# Altium project ECE453-PWR.PrjPcb
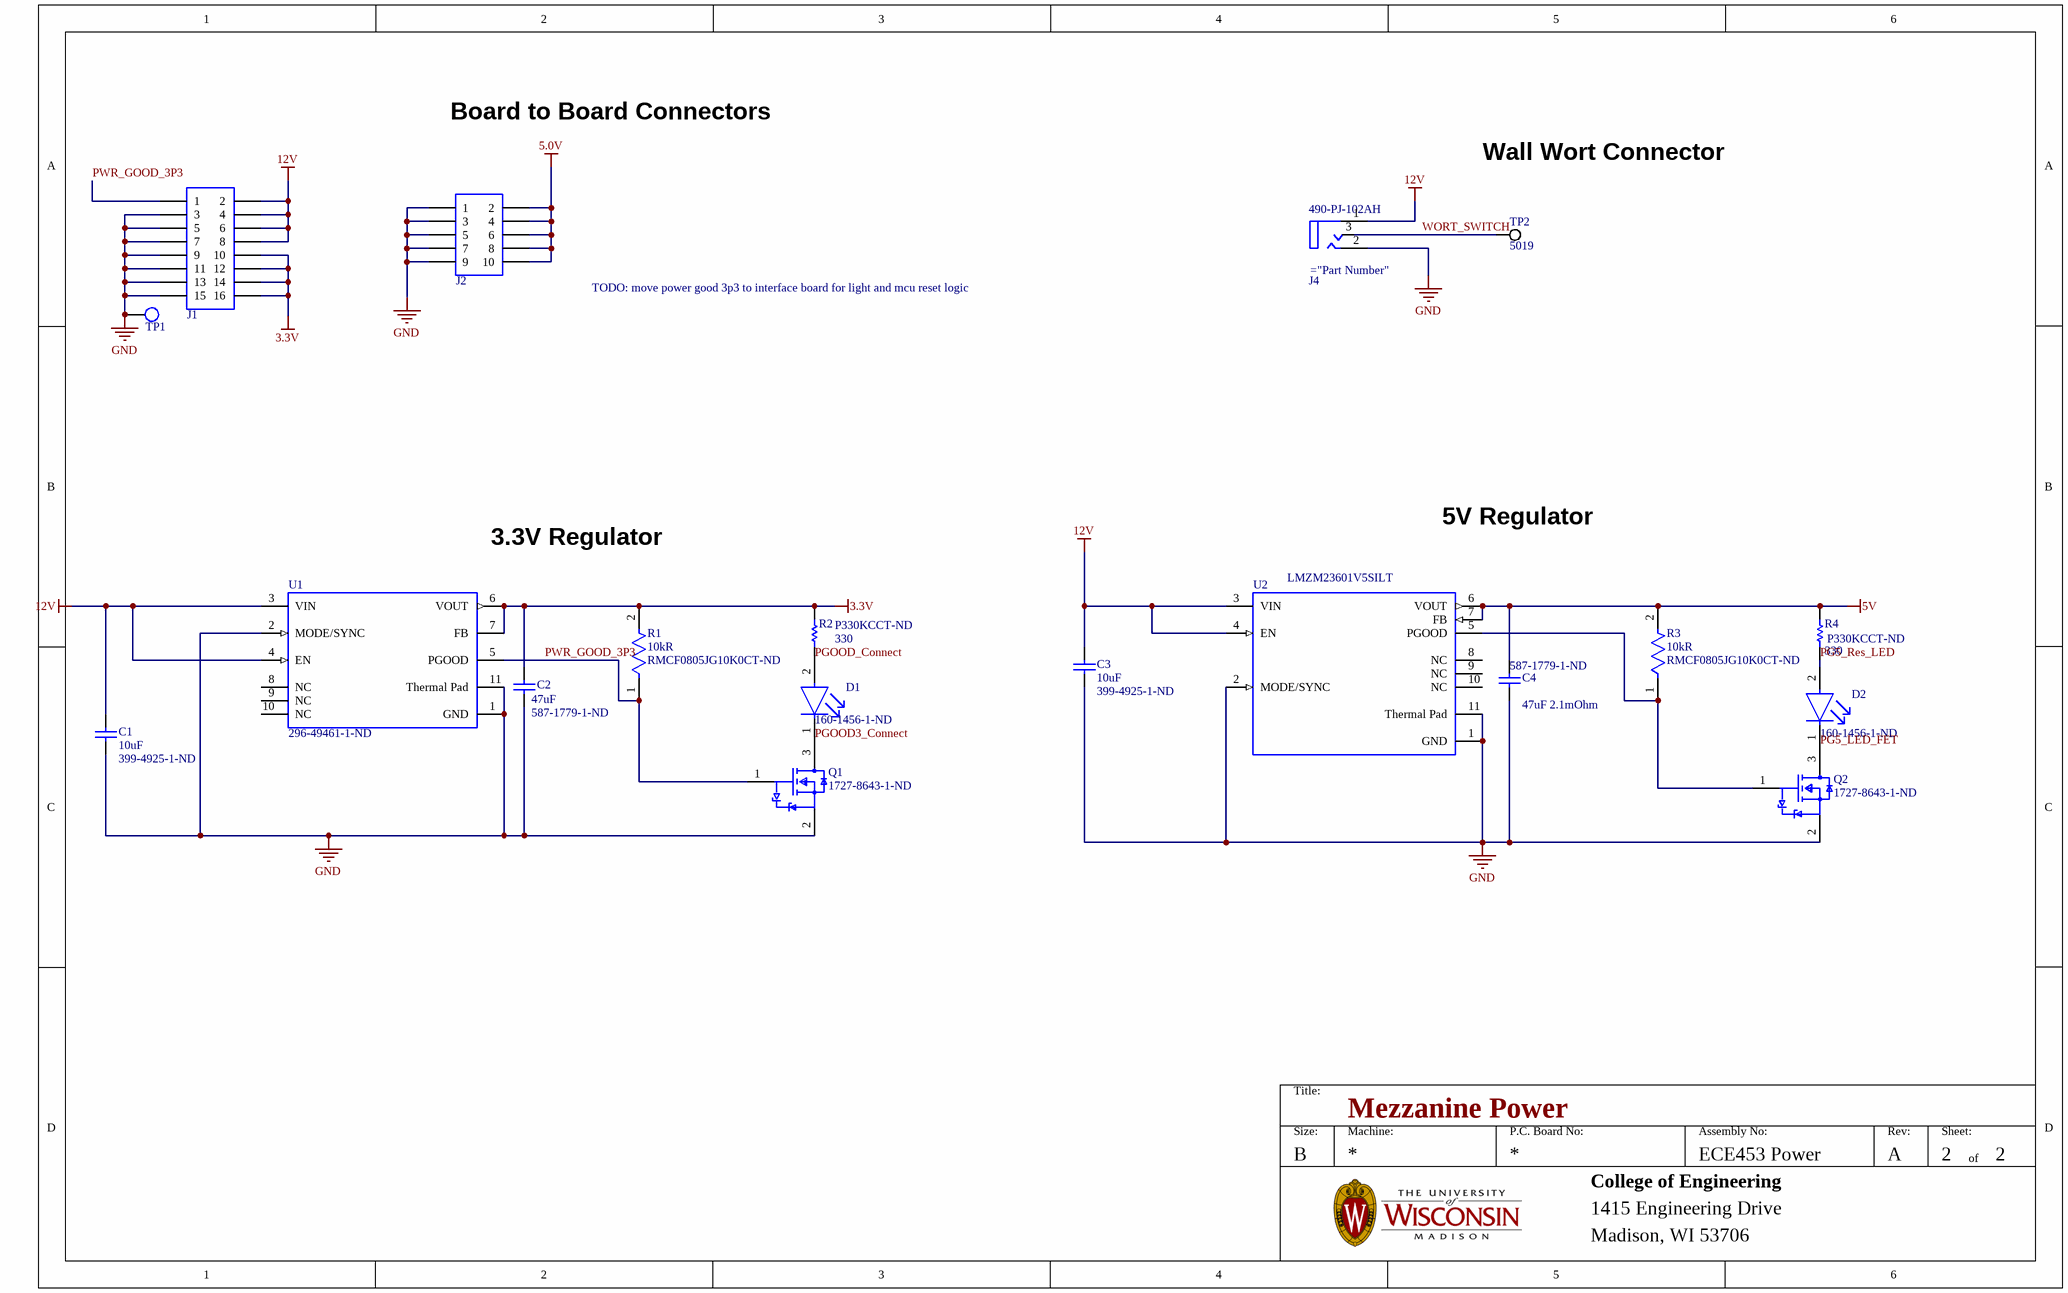
[diagram p0: 02 Mobile Power.SchDoc]
1 sheet, 19 parts. Net scope: global (net labels, ports and power ports of the same name join across sheets).
Board file: ECE453_PWR.PcbDoc

## Sheet 02 Mobile Power.SchDoc: Mezzanine Power
size B; Author: JSK; Revision: A; SheetNumber: 2; SheetTotal: 2; AssemblyNumber: ECE453 Power; CurrentDate: 1/09/2018

### Parts
C1  value 10uF  Supplier Part Number 1: 399-4925-1-ND  [6-0805_M]  (hidden comment: Cap)
C2  value 47uF  Supplier Part Number 1: 587-1779-1-ND  [6-0805_M]  (hidden comment: Cap)
C3  value 10uF  Supplier Part Number 1: 399-4925-1-ND  [6-0805_M]  (hidden comment: Cap)
C4  value 47uF 2.1mOhm  Supplier Part Number 1: 587-1779-1-ND  [6-0805_M]  (hidden comment: Cap)
D1  Supplier Part Number 1: 160-1456-1-ND  [Lite-On_LTST-C230KGKT_0]  (hidden comment: LTST-C230KGKT)
D2  Supplier Part Number 1: 160-1456-1-ND  [Lite-On_LTST-C230KGKT_0]  (hidden comment: LTST-C230KGKT)
J1  CONN_HEADER_MALE_8x2  [SBH11-PBPC-D08-ST-BK]  (value not drawn)
J2  CONN_HEADER_MALE_5x2  [SBH11-PBPC-D05-ST-BK]  (value not drawn)
J4  Supplier Part Number 1: 490-PJ-102AH  [CUI_PJ-102AH_0]  (hidden comment: PJ-102AH)
Q1  Supplier Part Number 1: 1727-8643-1-ND  [Nexperia_USA_Inc_SOT23_IPC_B]  (hidden comment: 2N7002NXAKR)
Q2  Supplier Part Number 1: 1727-8643-1-ND  [Nexperia_USA_Inc_SOT23_IPC_B]  (hidden comment: 2N7002NXAKR)
R1  Resistance: 10kR  Supplier Part Number 1: RMCF0805JG10K0CT-ND  [0805]  (hidden comment: RMCF0805JG10K0)
R2  value 330  Supplier Part Number 1: P330KCCT-ND  [6-0805_M]  (hidden comment: Res1)
R3  Resistance: 10kR  Supplier Part Number 1: RMCF0805JG10K0CT-ND  [0805]  (hidden comment: RMCF0805JG10K0)
R4  value 330  Supplier Part Number 1: P330KCCT-ND  [6-0805_M]  (hidden comment: Res1)
TP1  TP_1206  [TP-SMC-1206]  (value not drawn)
TP2  5019  [KSTN-5019_V]
U1  Supplier Part Number 1: 296-49461-1-ND  [Texas_Instruments_SIL0010A_MFG]  (hidden comment: LMZM23601V3SILT)
U2  LMZM23601V5SILT  [Texas_Instruments_SIL0010A_MFG]

### Nets
3.3V: C2.2 J1.10 J1.12 J1.14 J1.16 R1.2 R2.2 U1.6(VOUT) U1.7(FB)
5.0V: J2.2 J2.4 J2.6 J2.8 J2.10
5V: C4.2 R3.2 R4.2 U2.6(VOUT) U2.7(FB)
12V: C1.2 C3.2 J1.2 J1.4 J1.6 J1.8 J4.1 U1.3(VIN) U1.4(EN) U2.3(VIN) U2.4(EN)
GND: C1.1 C2.1 C3.1 C4.1 J1.3 J1.5 J1.7 J1.9 J1.11 J1.13 J1.15 J2.1 J2.3 J2.5 J2.7 J2.9 J4.2 Q1.2(S) Q2.2(S) TP1.1 U1.1(GND) U1.2(MODE/SYNC) U1.11(Thermal_Pad) U2.1(GND) U2.2(MODE/SYNC) U2.11(Thermal_Pad)
PG5_LED_FET: D2.1(C) Q2.3(D)
PG5_Res_LED: D2.2(A) R4.1
PGOOD3_Connect: D1.1(C) Q1.3(D)
PGOOD_Connect: D1.2(A) R2.1
PWR_GOOD_3P3: J1.1 Q1.1(G) R1.1 U1.5(PGOOD)
WORT_SWITCH: J4.3 TP2.1
NetQ2_1: Q2.1(G) R3.1 U2.5(PGOOD)

Not connected (* = marked no-connect by the designer): U1 8(NC) 9(NC) 10(NC); U2 8(NC) 9(NC) 10(NC)

### Notes on the sheet
- Board to Board Connectors
- Wall Wort Connector
- TODO: move power good 3p3 to interface board for light and mcu reset logic
- 3.3V Regulator
- 5V Regulator
- Title:
- Size:
- B
- Machine:
- P.C. Board No:
- Assembly No:
- Rev:
- Sheet:
- of
- College of Engineering
- 1415 Engineering Drive
- Madison, WI 53706

### Library data of the parts
C1-C4 = Cap: Capacitor; Published: 8-Jun-2000; LatestRevisionDate: 17-Jul-2002; LatestRevisionNote: Re-released for DXP Platform.; PackageReference: RAD-0.3; Publisher: Altium Limited; PackageDescription: Radial Cap, Thru-Hole; 2 Leads; 0.3 in Pin Spacing; Supplier 1: Digi-Key
D1 D2 = LTST-C230KGKT: LED GREEN CLEAR CHIP SMD; Manufacturer: Vishay Lite-On; Lens Color: Colorless; Forward Voltage: 2V; Luminous Intensity: 35mcd; Viewing Angle: 130°; Dominant Wavelength: 571nm; Test Current: 20mA; Wavelength: 574nm; Forward Current: 30mA; Power Rating: 75mW; Lens Style: Diffused,Colorless,Clear,Rectangular; Number of Elements: 1; Reverse Voltage: 5V; Supplier 1: Digi-Key; Manufacturer Part Number: LTST-C230KGKT; RoHS: Yes; Category: LEDs; Stock 1: 244034; Pricing 1: 1=0.31000, 10=0.16700, 100=0.07740, 500=0.07140, 1000=0.05593 (USD); Mount: Surface Mount; Case/Package: 1206; Number of Pins: 2; Color: Green; Case Code (Metric): 3216; Case Code (Imperial): 1206; Min Operating Temperature: -55°C; Max Operating Temperature: 85°C; Packaging: Tape and Reel; Package Quantity: 1; Lens Transparency: Clear; Illumination Color: Green; Power Dissipation: 75mW; Number of LEDs: 1; Length: 3.2mm; Width: 1.6mm; Height: 1.1mm; Depth: 1.6mm; Radiation Hardening: No; Lead Free: Lead Free; RoHS Compliant: Yes; ComponentLink1URL: https://datasheet.ciiva.com/15118/getdatasheetpartid-214545-15118102.pdf?src-supplier=Verical; ComponentLink1Description: https://datasheet.ciiva.com/15118/getdatasheetpartid-214545-15118102.pdf?src-supplier=Verical; ComponentLink2URL: https://datasheet.ciiva.com/12400/lite-on-ltst-c230kgkt-190174-12400698.pdf?src-supplier=Mouser; ComponentLink2Description: https://datasheet.ciiva.com/12400/lite-on-ltst-c230kgkt-190174-12400698.pdf?src-supplier=Mouser; ComponentLink3URL: https://datasheet.ciiva.com/11773/0900766b80dc057a-11773900.pdf?src-supplier=RSComponents; ComponentLink3Description: https://datasheet.ciiva.com/11773/0900766b80dc057a-11773900.pdf?src-supplier=RSComponents; ComponentLink4URL: https://datasheet.ciiva.com/2110/s-110-ltst-c230kgkt-2110033.pdf?src-supplier=Digi-Key; ComponentLink4Description: https://datasheet.ciiva.com/2110/s-110-ltst-c230kgkt-2110033.pdf?src-supplier=Digi-Key; ComponentLink5URL: https://datasheet.ciiva.com/2110/s-110-ltst-c230kgkt-2110034.pdf?src-supplier=Digi-Key; ComponentLink5Description: https://datasheet.ciiva.com/2110/s-110-ltst-c230kgkt-2110034.pdf?src-supplier=Digi-Key; ComponentLink6URL: https://datasheet.ciiva.com/2110/s-110-ltst-c230kgkt-2110035.pdf?src-supplier=Digi-Key; ComponentLink6Description: https://datasheet.ciiva.com/2110/s-110-ltst-c230kgkt-2110035.pdf?src-supplier=Digi-Key
J1 = CONN_HEADER_MALE_8x2: CONN HEADER 2.54MM 16POS GOLD; Manufacturer: Sullins Connector Solutions; Pitch: 0.100" (2.54mm); Number of Positions Loaded: All; Number of Positions: 16; Connector Type: Header, Shrouded; Contact Finish Thickness: Flash; Contact Mating Length: -; Fastening Type: -; Contact Finish: Gold; Packaging: Tray; Row Spacing: 0.100" (2.54mm); RoHS: RoHS Compliant; Contact Type: Male Pin; Category: Connectors, Interconnects; Part Status: Active; Features: Polarizing Key; Color: Black; Mounting Type: Through Hole; Termination: Solder; Manufacturer Part Number: SBH11-PBPC-D08-ST-BK; Number of Rows: 2; Supplier 1: Digi-Key; Stock 1: 13784; Pricing 1: 1=0.55, 10=0.428, 25=0.3988, 50=0.3626, 100=0.3263, 250=0.27552, 500=0.261, 1000=0.232, 2500=0.19285 (USD); ComponentLink1URL: http://sullinscorp.com/catalogs/145_PAGE118_.100_SBH11_SERIES_MALE_BOX_HDR_ST_RA_SMT.pdf; ComponentLink1Description: http://sullinscorp.com/catalogs/145_PAGE118_.100_SBH11_SERIES_MALE_BOX_HDR_ST_RA_SMT.pdf; Supplier Part Number 1: S9171-ND
J2 = CONN_HEADER_MALE_5x2: CONN HEADER 2.54MM 10POS GOLD; Manufacturer: Sullins Connector Solutions; Pitch: 0.100" (2.54mm); Number of Positions: 10; Number of Positions Loaded: All; Connector Type: Header, Shrouded; Contact Mating Length: -; Fastening Type: -; Termination: Solder; Mounting Type: Through Hole; Color: Black; Contact Finish Thickness: Flash; Row Spacing: 0.100" (2.54mm); Contact Finish: Gold; Number of Rows: 2; Features: Polarizing Key; Contact Type: Male Pin; Manufacturer Part Number: SBH11-PBPC-D05-ST-BK; Category: Connectors, Interconnects; Packaging: Tray; Part Status: Active; RoHS: RoHS Compliant; Supplier 1: Digi-Key; Stock 1: 29227; Pricing 1: 1=0.64, 10=0.445, 25=0.3812, 50=0.343, 100=0.2985, 250=0.254, 500=0.2413, 1000=0.2159, 2500=0.17145 (USD); ComponentLink1URL: http://sullinscorp.com/catalogs/145_PAGE118_.100_SBH11_SERIES_MALE_BOX_HDR_ST_RA_SMT.pdf; ComponentLink1Description: http://sullinscorp.com/catalogs/145_PAGE118_.100_SBH11_SERIES_MALE_BOX_HDR_ST_RA_SMT.pdf; Supplier Part Number 1: S9169-ND
J4 = PJ-102AH: 2.0 x 6.5 mm, 5.0 A, Horizontal, Through Hole, Tapered Pins, Dc Power Jack Connector; Manufacturer: CUI; Gender: Male; Shielding: Unshielded; Current Rating: 5A; Voltage Rating: 24V; Insulation Resistance: 50MR; Number of Conductors: 2; Supplier 1: Mouser; Manufacturer Part Number: PJ-102AH; RoHS: Yes; Category: Connectors; Mount: Through Hole; Color: Black; Contact Material: Copper; Contact Plating: Nickel; Housing Color: Black; Housing Material: Thermoplastic; Min Operating Temperature: -25°C; Max Operating Temperature: 85°C; Package Quantity: 280; Termination: Through Hole; Connector Type: Jack; Contact Gender: Male; Series: -; Orientation: Horizontal; Packaging: Bulk; Diameter: 2.1mm; Lead Free: Lead Free; Flammability Rating: UL94 V-0; RoHS Compliant: Yes; ComponentLink1URL: http://www.mouser.com/ds/2/670/PJ-102AH-524179.pdf?src-supplier=Mouser; ComponentLink1Description: http://www.mouser.com/ds/2/670/PJ-102AH-524179.pdf?src-supplier=Mouser; ComponentLink2URL: https://www.cui.com/product/resource/digikeypdf/pj-102ah.pdf?src-supplier=Digi-Key; ComponentLink2Description: https://www.cui.com/product/resource/digikeypdf/pj-102ah.pdf?src-supplier=Digi-Key; ComponentLink3URL: http://www.cui.com/Product/Resource/FuturePDF/PJ-102AH.pdf?src-supplier=Future+Electronics; ComponentLink3Description: http://www.cui.com/Product/Resource/FuturePDF/PJ-102AH.pdf?src-supplier=Future+Electronics
Q1 Q2 = 2N7002NXAKR: 2N7002NXAK - 60 V, single N-channel Trench MOSFET; Manufacturer: Nexperia; Supplier 1: Digi-Key; Manufacturer Part Number: 2N7002NXAKR; RoHS: No; Stock 1: 74376; Pricing 1: 1=0.10000, 10=0.05600, 25=0.05360, 100=0.03030, 500=0.02380, 1000=0.01653 (USD)
R1 R3 = RMCF0805JG10K0: Res Thick Film 0805 10K Ohm 5% 1/8W ±200ppm/°C Molded SMD Paper T/R; Manufacturer: Stackpole Electronics; Max Power Dissipation: 125mW; Supplier 1: Digi-Key; Manufacturer Part Number: RMCF0805JG10K0; RoHS: Yes; Category: Chip SMD Resistors; Stock 1: 126198; Pricing 1: 1=0.10000, 10=0.01900, 100=0.00780, 1000=0.00350, 2500=0.00304, 5000=0.00251 (USD); Mount: Surface Mount; Case/Package: 0805; Case Code (Metric): 2012; Case Code (Imperial): 0805; Contact Plating: Tin,Matte; Min Operating Temperature: -55°C; Max Operating Temperature: 155°C; Packaging: Tape and Reel; Tolerance: 5%; Resistor Type: Thick Film; Number of Terminations: 2; Package Quantity: 10000; Temperature Coefficient: 200ppm/°C; Features: Automotive AEC-Q200; Series: RMCF; Length: 0.079inch; Width: 0.049inch; Height: 0.026inch; Radiation Hardening: No; RoHS Compliant: Yes; ComponentLink1URL: https://www.seielect.com/catalog/SEI-Packaging.pdf?src-supplier=Digi-Key; ComponentLink1Description: https://www.seielect.com/catalog/SEI-Packaging.pdf?src-supplier=Digi-Key; ComponentLink2URL: https://www.seielect.com/Catalog/SEI-RMCF_RMCP.pdf?src-supplier=Digi-Key; ComponentLink2Description: https://www.seielect.com/Catalog/SEI-RMCF_RMCP.pdf?src-supplier=Digi-Key; ComponentLink3URL: http://www.seielect.com/Catalog/SEI-RMCF_RMCP.pdf?src-supplier=Digi-Key; ComponentLink3Description: http://www.seielect.com/Catalog/SEI-RMCF_RMCP.pdf?src-supplier=Digi-Key; ComponentLink4URL: https://www.seielect.com/catalog/SEI-RMCF_RMCP.pdf?src-supplier=Avnet; ComponentLink4Description: https://www.seielect.com/catalog/SEI-RMCF_RMCP.pdf?src-supplier=Avnet; ComponentLink5URL: http://components.arrow.com/part/dataview/40965385S7746077N1174?src-supplier=Arrow+Electronics; ComponentLink5Description: http://components.arrow.com/part/dataview/40965385S7746077N1174?src-supplier=Arrow+Electronics
R2 R4 = Res1: SMD Chip Resistor, 0805 [2012 Metric], 330 kohm, ERJ6EN Series, 150 V, Thick Film, 125 mW; Manufacturer: Panasonic; Manufacturer Part Number: ERJ6ENF3303V; Resistance: 330kR; Power Rating: 125mW; Tolerance: 1%; Temperature Coefficient: 100ppm/°C; Voltage Rating: 150V; Published: 8-Jun-2000; LatestRevisionDate: 17-Jul-2002; LatestRevisionNote: Re-released for DXP Platform.; PackageReference: AXIAL-0.3; Publisher: Altium Limited; PackageDescription: Axial Device, Thru-Hole; 2 Leads; 0.3 in Pin Spacing; Supplier 1: Digi-Key; RoHS: Yes; Category: Chip SMD Resistors; Stock 1: 9622; Pricing 1: 1=0.10000, 10=0.07200, 100=0.02750, 1000=0.01210, 2500=0.01045 (USD); Mount: Surface Mount; Case/Package: 0805; Number of Pins: 2; Case Code (Metric): 2012; Case Code (Imperial): 0805; Contact Plating: Tin; Min Operating Temperature: -55°C; Max Operating Temperature: 155°C; Packaging: Tape and Reel; Resistor Type: Thick Film; Number of Terminations: 2; Max Power Dissipation: 125mW; Series: ERJ; Termination: SMD/SMT; Construction: Rectangular; Package Quantity: 1; Features: Automotive AEC-Q200; Resistance Tolerance: 1%; Technology: THICK FILM; Length: 2mm; Width: 0.049inch; Height: 0.6mm; Depth: 1.25mm; Radiation Hardening: No; RoHS Compliant: Yes; Military Standard: Not; REACH SVHC: No SVHC; ComponentLink1URL: https://datasheet.ciiva.com/11821/0900766b80f80784-11821637.pdf?src-supplier=RSComponents; ComponentLink1Description: https://datasheet.ciiva.com/11821/0900766b80f80784-11821637.pdf?src-supplier=RSComponents; ComponentLink2URL: https://datasheet.ciiva.com/9183/aoa0000ce2-9183029.pdf?src-supplier=Avnet; ComponentLink2Description: https://datasheet.ciiva.com/9183/aoa0000ce2-9183029.pdf?src-supplier=Avnet; ComponentLink3URL: https://datasheet.ciiva.com/24026/aoa0000ce2-24026247.pdf?src-supplier=Mouser; ComponentLink3Description: https://datasheet.ciiva.com/24026/aoa0000ce2-24026247.pdf?src-supplier=Mouser; ComponentLink4URL: https://datasheet.ciiva.com/46420/1678782-46420183.pdf?src-supplier=Element14; ComponentLink4Description: https://datasheet.ciiva.com/46420/1678782-46420183.pdf?src-supplier=Element14; ComponentLink5URL: https://datasheet.ciiva.com/7836/426256-7836824.pdf?src-supplier=Element14; ComponentLink5Description: https://datasheet.ciiva.com/7836/426256-7836824.pdf?src-supplier=Element14; ComponentLink6URL: https://datasheet.ciiva.com/17206/aoa0000ce2-17206265.pdf?src-supplier=Avnet+Europe; ComponentLink6Description: https://datasheet.ciiva.com/17206/aoa0000ce2-17206265.pdf?src-supplier=Avnet+Europe; ComponentLink7URL: https://datasheet.ciiva.com/16761/70260748-16761642.pdf?src-supplier=Allied+Electronics; ComponentLink7Description: https://datasheet.ciiva.com/16761/70260748-16761642.pdf?src-supplier=Allied+Electronics; ComponentLink8URL: https://datasheet.ciiva.com/7836/426256-7836539.pdf?src-supplier=Element14; ComponentLink8Description: https://datasheet.ciiva.com/7836/426256-7836539.pdf?src-supplier=Element14; ComponentLink9URL: https://datasheet.ciiva.com/5915/426256-5915341.pdf?src-supplier=Farnell; ComponentLink9Description: https://datasheet.ciiva.com/5915/426256-5915341.pdf?src-supplier=Farnell; ComponentLink10URL: https://datasheet.ciiva.com/16765/70260748-16765294.pdf?src-supplier=Allied+Electronics; ComponentLink10Description: https://datasheet.ciiva.com/16765/70260748-16765294.pdf?src-supplier=Allied+Electronics; ComponentLink11URL: https://datasheet.ciiva.com/22673/1678782-22673294.pdf?src-supplier=Element14; ComponentLink11Description: https://datasheet.ciiva.com/22673/1678782-22673294.pdf?src-supplier=Element14; ComponentLink12URL: https://datasheet.ciiva.com/22687/1678782-22687438.pdf?src-supplier=Element14; ComponentLink12Description: https://datasheet.ciiva.com/22687/1678782-22687438.pdf?src-supplier=Element14
TP1 = TP_1206: Test Point SMD 1206; Supplier 1: Digi-Key; Supplier Part Number 1: A106143CT-ND
TP2 = 5019: Test Point, 1 Position SMD, RoHS, Tape and Reel; RoHSCompliant: True; ComponentLink1Description: Manufacturer URL; ComponentLink2Description: Datasheet; Package Quantity: 1000; Mount: Surface Mount; DatasheetVersion: 03/2014; ComponentLink1URL: http://www.keyelco.com/; Packaging: Tape and Reel; Contact Plating: Silver; Pins: 1; Mounting Technology: Surface Mount; PackageDescription: 1-Pin Surface Mount Device, Body 3.81 x 2.03 mm; ComponentLink2URL: http://www.keyelco.com/product-pdf.cfm?p=1357; PackageReference: 5019; PartNumber: 5019
U1 = LMZM23601V3SILT: TEXAS INSTRUMENTS - LMZM23601V3SILT . - Convertidor DC/DC POL no Aislado, ITE, 1 Salida, 3 W, 3 V, 1 A, Fijo; Number of Outputs: 1; Min Input Voltage: 4V; Max Input Voltage: 36V; Voltage - Output 1: 3.3V; Max Output Current: 1A; Efficiency: 81%; Supplier 1: Digi-Key; Manufacturer: Texas Instruments; Manufacturer Part Number: LMZM23601V3SILT; RoHS: Yes; Category: Voltage Regulators - Switching; Stock 1: 689; Pricing 1: 1=6.54000, 10=5.87300, 25=5.55240, 100=4.56520 (USD); Mount: Surface Mount; Min Operating Temperature: -40°C; Max Operating Temperature: 125°C; Features: UVLO,OCP,SCP; Packaging: Cut Tape; RoHS Compliant: Yes; ComponentLink1URL: http://www.ti.com/lit/ds/symlink/lmzm23601.pdf?src-supplier=Digi-Key; ComponentLink1Description: http://www.ti.com/lit/ds/symlink/lmzm23601.pdf?src-supplier=Digi-Key; ComponentLink2URL: http://www.ti.com/lit/ds/symlink/lmzm23601.pdf?src-supplier=Farnell; ComponentLink2Description: http://www.ti.com/lit/ds/symlink/lmzm23601.pdf?src-supplier=Farnell
U2 = LMZM23601V5SILT: TEXAS INSTRUMENTS - LMZM23601V5SILT - Non Isolated POL DC/DC Converter, 1 Output, 5 W, 5 V, 1 A, Fixed; Number of Outputs: 1; Min Input Voltage: 4V; Max Input Voltage: 36V; Voltage - Output 1: 5V; Max Output Current: 1A; Efficiency: 87%; Supplier 1: Digi-Key; Manufacturer: Texas Instruments; Manufacturer Part Number: LMZM23601V5SILT; RoHS: Yes; Category: Voltage Regulators - Switching; Stock 1: 2317; Pricing 1: 1=6.54000, 10=5.87300, 25=5.55240, 100=4.56520 (USD); Mount: Surface Mount; Min Operating Temperature: -40°C; Max Operating Temperature: 125°C; Features: UVLO,OCP,SCP; Packaging: Tape and Reel; ComponentLink1URL: http://www.ti.com/lit/ds/symlink/lmzm23601.pdf?src-supplier=Farnell; ComponentLink1Description: http://www.ti.com/lit/ds/symlink/lmzm23601.pdf?src-supplier=Farnell; ComponentLink2URL: http://www.ti.com/lit/ds/symlink/lmzm23601.pdf?src-supplier=Digi-Key; ComponentLink2Description: http://www.ti.com/lit/ds/symlink/lmzm23601.pdf?src-supplier=Digi-Key; Supplier Part Number 1: 296-49462-1-ND